# EAGLE schematic 328vusb (EAGLE 6.4)
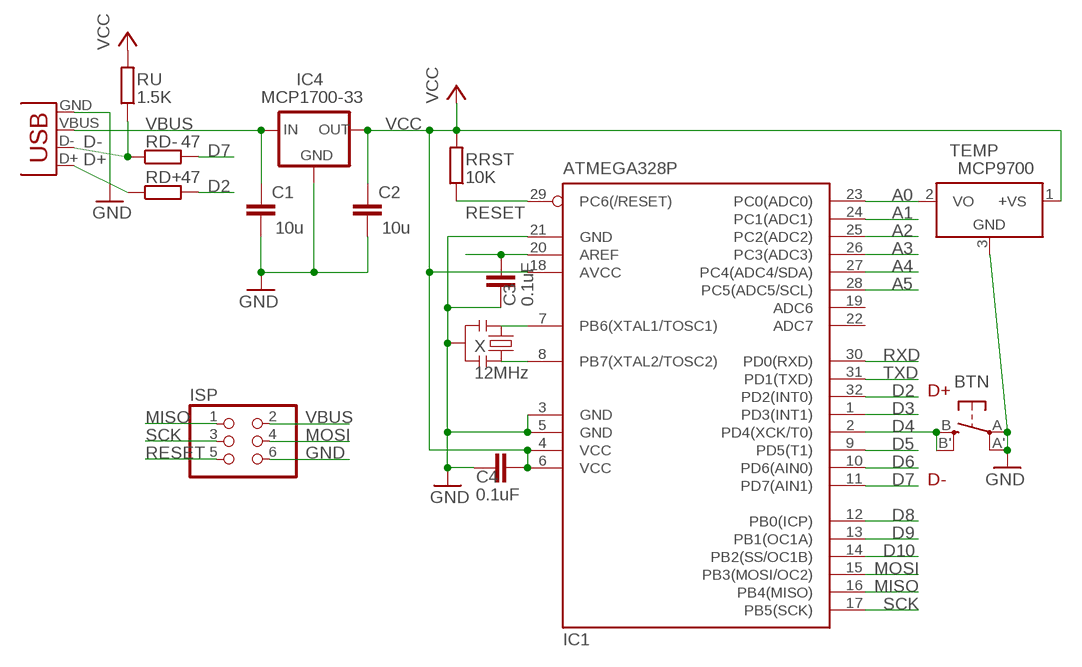
[diagram p0: schematic, sheet 1]

## Parts
BTN  EVQQ2  [EVQ-Q2]
C1  10u  C-EUC0805  [C0805]
C2  10u  C-EUC0805  [C0805]
C3  0.1uF  C-EUC0805  [C0805]
C4  0.1uF  C-EUC0805  [C0805]
IC1  ATMEGA328P  MEGA8-AI  [TQFP32-08]
IC4  MCP1700-33  MCP1700SOT233  [SOT23]
ISP  PINHD-2X3  [2X03]
RD+  47  R-EU_R0805  [R0805]
RD-  47  R-EU_R0805  [R0805]
RRST  10K  R-EU_R0805  [R0805]
RU  1.5K  R-EU_R0805  [R0805]
TEMP  MCP9700  LM50  [SOT23]
X  12MHz  RESONATORSMD  [RESONATOR-SMD]
X1  USBSMD  [USB-MINIB]

## Nets
A0: IC1.23(PC0(ADC0)) TEMP.2(VO)
A1: IC1.24(PC1(ADC1))
A2: IC1.25(PC2(ADC2))
A3: IC1.26(PC3(ADC3))
A4: IC1.27(PC4(ADC4/SDA))
A5: IC1.28(PC5(ADC5/SCL))
AREF: C3.2 IC1.20(AREF)
D2: IC1.32(PD2(INT0)) RD+.2
D3: IC1.1(PD3(INT1))
D4: BTN.B'(S1) BTN.B(S) IC1.2(PD4(XCK/T0))
D5: IC1.9(PD5(T1))
D6: IC1.10(PD6(AIN0))
D7: IC1.11(PD7(AIN1)) RD-.2
D8: IC1.12(PB0(ICP))
D9: IC1.13(PB1(OC1A))
D10: IC1.14(PB2(SS/OC1B))
D+: RD+.1 X1.D+
D-: RD-.1 RU.1 X1.D-
GND: BTN.A'(P1) BTN.A(P) C1.2 C2.2 C3.1 C4.1 IC1.3(GND) IC1.5(GND) IC1.21(GND) IC4.1(GND) ISP.6 TEMP.3(GND) X1.GND X.2
MISO: IC1.16(PB4(MISO)) ISP.1
MOSI: IC1.15(PB3(MOSI/OC2)) ISP.4
N$2: IC1.7(PB6(XTAL1/TOSC1)) X.1
N$3: IC1.8(PB7(XTAL2/TOSC2)) X.3
RESET: IC1.29(PC6(/RESET)) ISP.5 RRST.1
RXD: IC1.30(PD0(RXD))
SCK: IC1.17(PB5(SCK)) ISP.3
TXD: IC1.31(PD1(TXD))
VBUS: C1.1 IC4.3(IN) ISP.2 X1.VBUS
VCC: C2.1 C4.2 IC1.4(VCC) IC1.6(VCC) IC1.18(AVCC) IC4.2(OUT) RRST.2 RU.2 TEMP.1(+VS)
Unconnected: IC1.19(ADC6) IC1.22(ADC7)

## Notes on the sheet
- D+
- D-

## Library data of the parts
BTN = adafruit:EVQQ2: SMT 6mm switch, EVQQ2 series http://www.ladyada.net/library/eagle
C1 C2 = resistor:C-EU: CAPACITOR, European symbol
C3 C4 = rcl:C-EU: CAPACITOR, European symbol
IC1 = atmel:MEGA8: MICROCONTROLLER 8 Kbytes FLASH, 1 kbytes SRAM, 512 bytes EEPROM, USART, 6-channel 10 bit ADC, 2-channel 8 bit ADC Pin compatible with Atmega48, ATMega88, ATMega168 Source: avr.lbr; MPN: ATMEGA8-16AU; OC_FARNELL: 9171371; OC_NEWARK: 73M8863
IC4 = adafruit:MCP1700: VOLTAGE REGULATOR
ISP = pinhead:PINHD-2X3: PIN HEADER
RD+ RD- RRST RU = rcl:R-EU_: RESISTOR, European symbol
TEMP = linear:LM50: SOT-23 Single-Supply Centigrade Temperature Sensor Vout = (10mV/°C x Temp °C) +5mmmV Source: http://cache.national.com/ds/LM/LM50.pdf
X = SparkFunNew:RESONATOR: Resonator Small SMD resonator. This is the itty bitty 10/20MHz resonators with built in caps. CSTCE10M0G55 and CSTCE20M0V53. Footprint has been reviewed closely but hasn't been tested yet.
X1 = SparkFun:USB: USB Connectors USB-B-PTH is fully proven SKU : PRT-00139 USB-miniB is fully proven SKU : PRT-00587 USB-A-PCB is untested. USB-A-H is throughly reviewed, but untested. Spark Fun Electronics SKU : PRT-00437 USB-B-SMT is throughly reviewed, but untested. Needs silkscreen touching up. USB-A-S has not been used/tested USB-MB-H has not been used/tested

## Net classes
0 default: width 0.254 mm, clearance 0.203 mm
1 power: width 0.254 mm, clearance 0.203 mm